# Altium schematic sheet Hierarchical_Names.SchDoc
size 111 x 66 mm
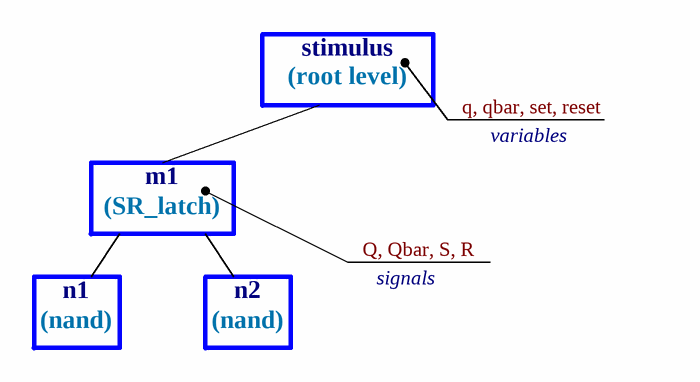
[diagram p0: Hierarchical_Names.SchDoc]

## Notes on the sheet
- stimulus
- (root level)
- q, qbar, set, reset
- m1
- variables
- (SR_latch)
- Q, Qbar, S, R
- n1
- (nand)
- n2
- signals